# EAGLE design M8-Quad-420mA-Boost (EAGLE 9.6.2)
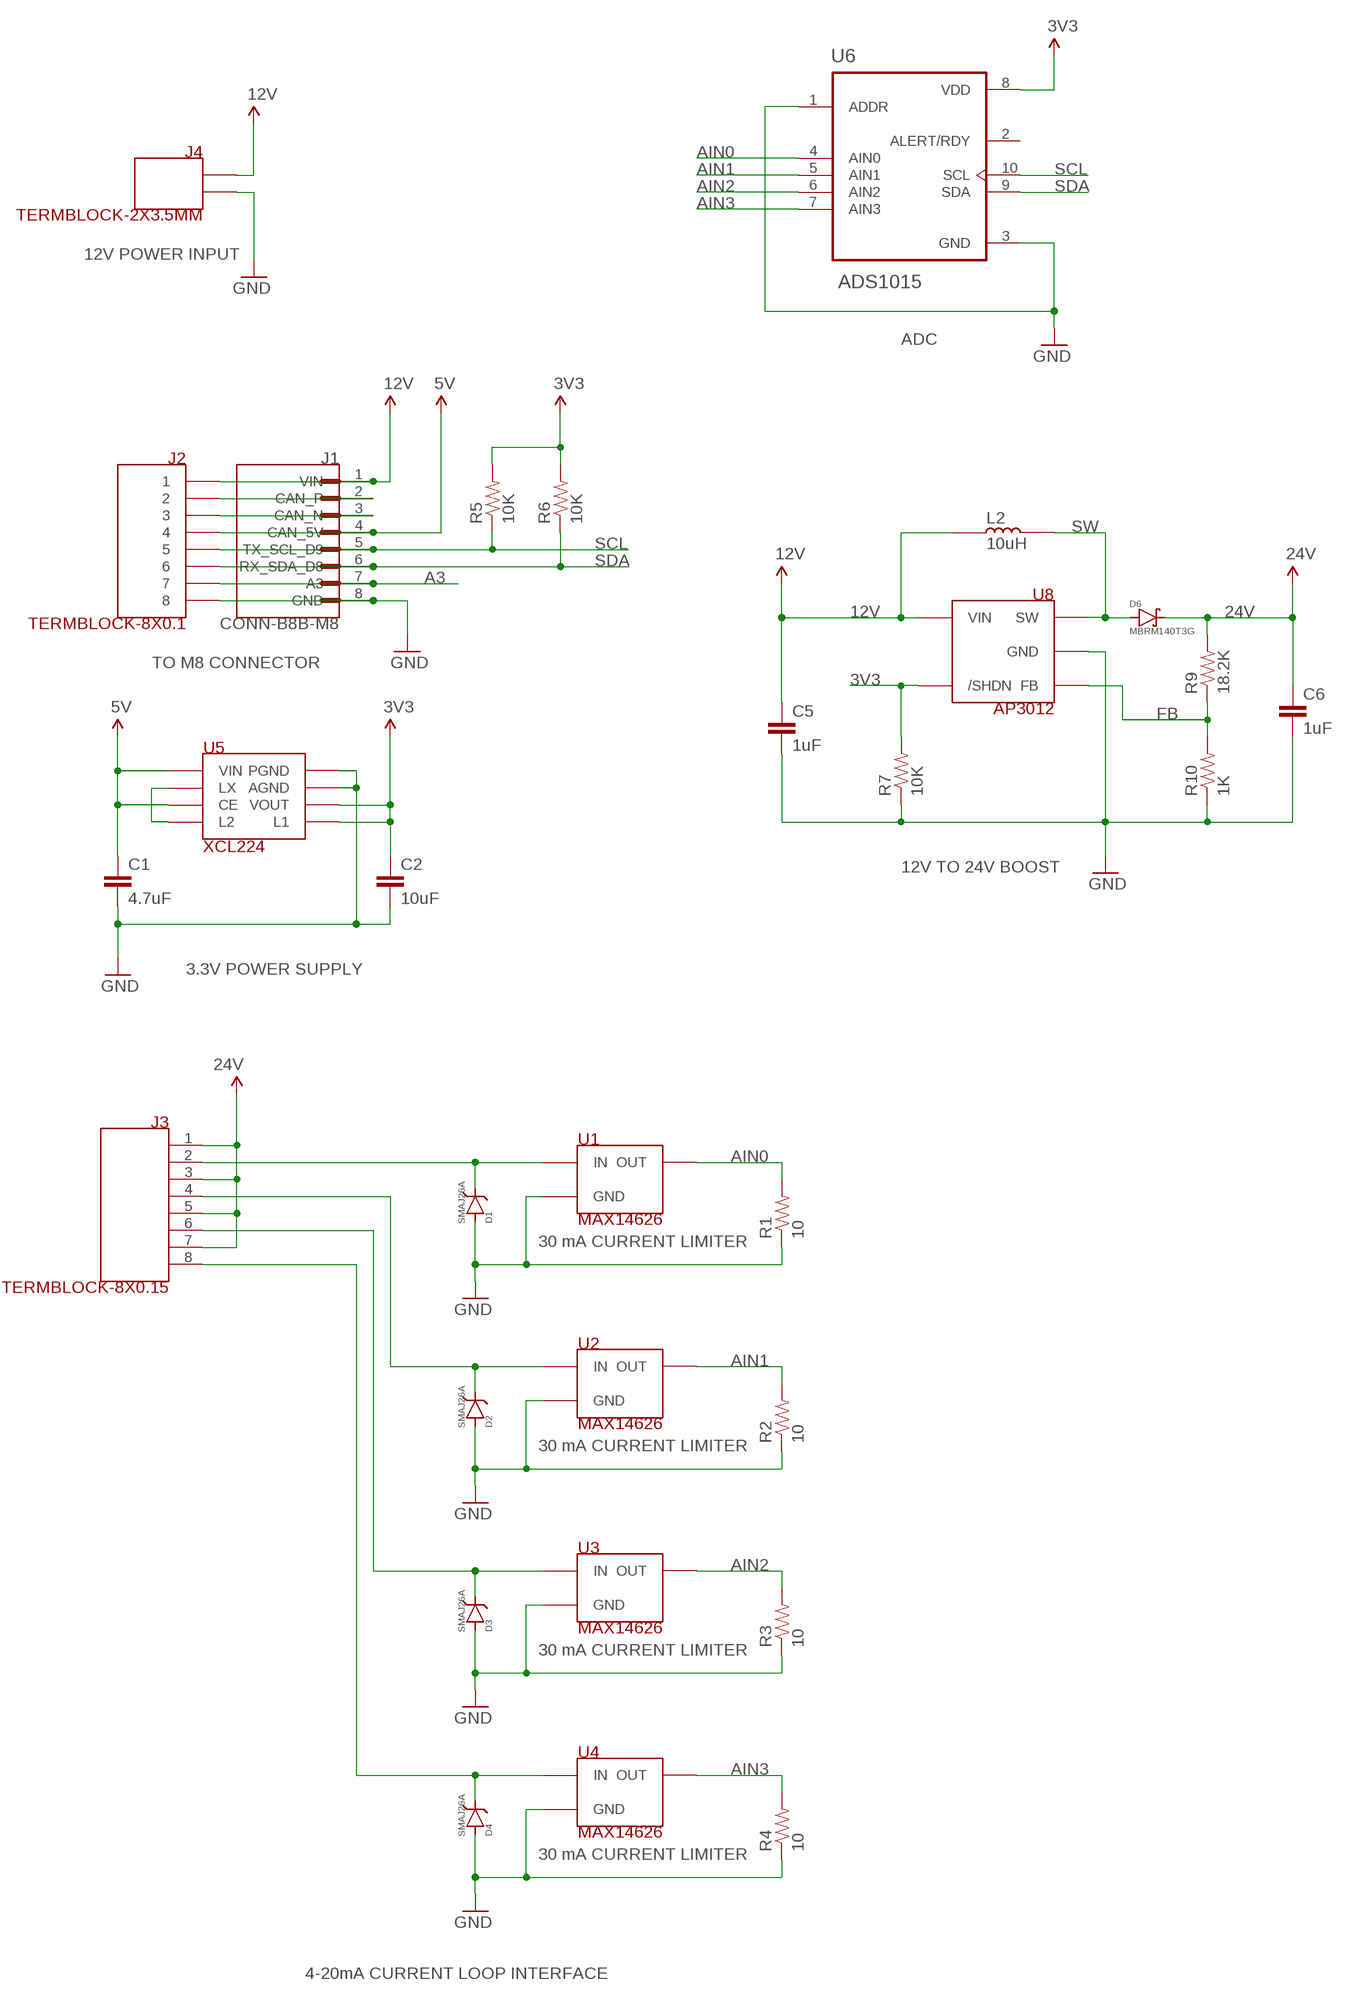
[diagram p0: schematic, sheet 1]

## Parts
C1  4.7uF  CAP-4.7UF-0603  [0603-CAP]
C2  10uF  CAP-10UF-0603  [0603-CAP]
C5  1uF  CAP-1UF-0603.DEV  [0603-CAP]
C6  1uF  CAP-1UF-0603.DEV  [0603-CAP]
D1  SMAJ26A  DIODE-TVS-SMAJ26A  [DO-214AC-LITTELFUSE]
D2  SMAJ26A  DIODE-TVS-SMAJ26A  [DO-214AC-LITTELFUSE]
D3  SMAJ26A  DIODE-TVS-SMAJ26A  [DO-214AC-LITTELFUSE]
D4  SMAJ26A  DIODE-TVS-SMAJ26A  [DO-214AC-LITTELFUSE]
D6  MBRM140T3G  [MBRM140T3G]
J1  CONN-B8B-M8  [JST_B8B-PH-SM4-TB(LF)(SN)]
J2  TERMBLOCK-8X0.1  [TERMBLOCK-8X0.1]
J3  TERMBLOCK-8X0.15  [TERMBLOCK-8X0.15]
J4  TERMBLOCK-2X3.5MM  [TERMBLOCK-2X3.5MM]
L2  10uH  INDUCTOR-10UH  [BOURNS-INDUCTOR-3X3]
R1  10  RES-100-0603.DEV  [0603-RES]
R2  10  RES-100-0603.DEV  [0603-RES]
R3  10  RES-100-0603.DEV  [0603-RES]
R4  10  RES-100-0603.DEV  [0603-RES]
R5  10K  RES-10K-06030603  [0603-RES]
R6  10K  RES-10K-06030603  [0603-RES]
R7  10K  RES-10K-06030603  [0603-RES]
R9  18.2K  RES-18.2K-06030603  [0603-RES]
R10  1K  RES-2.2K-06030603  [0603-RES]
U1  MAX14626  [6-TDFN-MAXIM]
U2  MAX14626  [6-TDFN-MAXIM]
U3  MAX14626  [6-TDFN-MAXIM]
U4  MAX14626  [6-TDFN-MAXIM]
U5  XCL224  REG-XCL223  [REG-XCL223-LESS-CREAM]
U6  ADS1015  ADS1015IDGSR  [SOP50P490X110-10N]
U8  AP3012  [SOT-23-5]

## Nets
3V3: C2.1 R5.2 R6.2 R7.2 U5.3(VOUT) U5.7(L1) U6.8(VDD) U8.4(/SHDN)
5V: C1.1 J1.4(CAN_5V) J2.P$4 U5.4(CE) U5.6(VIN)
12V: C5.1 J1.1(VIN) J2.P$1 J4.1 L2.1 U8.5(VIN)
24V: C6.1 D6.1(CATHODE) J3.1 J3.3 J3.5 J3.7 R9.2
A3: J1.7(A3) J2.P$7
AIN0: R1.2 U1.6(OUT) U6.4(AIN0)
AIN1: R2.2 U2.6(OUT) U6.5(AIN1)
AIN2: R3.2 U3.6(OUT) U6.6(AIN2)
AIN3: R4.2 U4.6(OUT) U6.7(AIN3)
CAN_N: J1.3(CAN_N) J2.P$3
CAN_P: J1.2(CAN_P) J2.P$2
FB: R9.1 R10.2 U8.3(FB)
GND: C1.2 C2.2 C5.2 C6.2 D1.A(ANODE) D2.A(ANODE) D3.A(ANODE) D4.A(ANODE) J1.8(GND) J2.P$8 J4.2 R1.1 R2.1 R3.1 R4.1 R7.1 R10.1 U1.2(GND) U1.3(GND) U1.4(GND) U1.5(GND) U1.EP(GND) U2.2(GND) U2.3(GND) U2.4(GND) U2.5(GND) U2.EP(GND) U3.2(GND) U3.3(GND) U3.4(GND) U3.5(GND) U3.EP(GND) U4.2(GND) U4.3(GND) U4.4(GND) U4.5(GND) U4.EP(GND) U5.1(PGND) U5.2(AGND) U6.1(ADDR) U6.3(GND) U8.2(GND)
LX: U5.5(LX) U5.8(L2)
SCL: J1.5(TX_SCL_D9) J2.P$5 R5.1 U6.10(SCL)
SDA: J1.6(RX_SDA_D8) J2.P$6 R6.1 U6.9(SDA)
SEN1: D1.C(CATHODE) J3.2 U1.1(IN)
SEN2: D2.C(CATHODE) J3.4 U2.1(IN)
SEN3: D3.C(CATHODE) J3.6 U3.1(IN)
SEN4: D4.C(CATHODE) J3.8 U4.1(IN)
SW: D6.2(ANODE) L2.2 U8.1(SW)
Unconnected: U6.2(ALERT/RDY)

## Notes on the sheet
- 12V POWER INPUT
- ADC
- TO M8 CONNECTOR
- 12V TO 24V BOOST
- 3.3V POWER SUPPLY
- 30 mA CURRENT LIMITER
- 30 mA CURRENT LIMITER
- 30 mA CURRENT LIMITER
- 30 mA CURRENT LIMITER
- 4-20mA CURRENT LOOP INTERFACE

## Library data of the parts
C1 = rickk2:CAP-4.7UF-0603: Murata X5R series CAP CER 4.7UF 6.3V X5R 0603 $0.12 https://www.digikey.com/product-detail/en/murata-electronics-north-america/GRM188R60J475KE19J/490-6407-1-ND/3845604
C2 = rickk2:CAP-10UF-0603: CAP CER 10UF 16V X5R 0805 $ 0.21 https://www.digikey.com/product-detail/en/murata-electronics-north-america/GRM21BR61C106KE15L/490-3886-1-ND/965928
C5 C6 = rickk2:CAP-1UF-0603.DEV: CAP CER 1UF 25V X7R 0603 $ 0.10 Samsung CL10B105KA8NNNC https://www.digikey.com/product-detail/en/samsung-electro-mechanics-america-inc/CL10B105KA8NNNC/1276-1184-1-ND/3889270 1µF ±10% 25V Ceramic Capacitor X7R 0603 (1608 Metric)
D1-D4 = rickk2:DIODE-TVS-SMAJ26A: Not ordered yet TVS diode for 24V 4-20mA circuits Littelfuse Inc. SMAJ26A $ 0.36 TVS DIODE 26V 42.1V DO214AC 42.1V Clamp 9.5A Ipp Tvs Diode Surface Mount DO-214AC (SMA) https://www.digikey.com/product-detail/en/littelfuse-inc/SMAJ26A/SMAJ26ALFCT-ND/762502 Cathode (bar/stripe side) goes to signal, anode goes to GND
D6 = rickk2:MBRM140T3G: Not ordered yet Schottky Diode for 24V boost with MIC2288 ON Semiconductor MBRM140T3G $0.36 DIODE SCHOTTKY 40V 1A POWERMITE Diode Schottky 40V 1A Surface Mount Powermite https://www.digikey.com/product-detail/en/on-semiconductor/MBRM140T3G/MBRM140T3GOSCT-ND/917997
J1 = rickk2:CONN-B8B-M8: PH Series 2 mm Pitch 12 Position SMT Single Row Top Entry Shrouded Header
J2 = rickk2:TERMBLOCK-8X0.1: Term Block 8x0.1" 20-30AWG 6A 125V Max Side Entry On Shore Technology Inc. OSTVN08A150 TERM BLK 8P SIDE ENT 2.54MM PCB 8 Position Wire to Board Terminal Block Horizontal with Board 0.100" (2.54mm) Through Hole https://www.digikey.com/product-detail/en/on-shore-technology-inc/OSTVN08A150/ED10566-ND/1588868
J3 = rickk2:TERMBLOCK-8X0.15: On Shore Technology Term Block 3.81 mm (.15”) Side with screw terminals: Plug, Female Sockets Board side: 90deg, Header, Male Pins, Shrouded (4 Side) TERM BLOCK HDR 8POS 90DEG 3.81MM $1.35 https://www.digikey.com/product-detail/en/on-shore-technology-inc/OSTOQ083251/ED2814-ND/1588131 TERM BLOCK PLUG 8POS STR 3.81MM $ 3.29 OSTTJ0831530 https://www.digikey.com/product-detail/en/on-shore-technology-inc/OSTTJ0831530/ED2881-ND/1588456
J4 = rickk2:TERMBLOCK-2X3.5MM: TERM BLK 2POS SIDE ENT 3.5MM PCB $0.67 On Shore Technology Inc. OSTTE020161M https://www.digikey.com/products/en?keywords=ED2635-ND
L2 = rickk2:INDUCTOR-10UH: Bourns Inc. SRN3015-100M $0.46 FIXED IND 10UH 1A 276 MOHM SMD 10µH Semi-Shielded Wirewound Inductor 1A 276 mOhm Max Nonstandard https://www.digikey.com/product-detail/en/bourns-inc/SRN3015-100M/SRN3015-100MCT-ND/2756149
R1-R4 = rickk2:RES-100-0603.DEV: RES SMD 100 OHM 5% 1/10W 0603 $ 0.10 ±5% 0.1W, 1/10W Chip Resistor 0603 (1608 Metric) Automotive AEC-Q200 Thick Film https://www.digikey.com/product-detail/en/panasonic-electronic-components/ERJ-3GEYJ101V/P100GCT-ND/134714; VALUE: 100
R5-R7 = rickk2:RES-10K-0603: RES SMD 10K OHM 5% 1/4W 0603 $ 0.10 https://www.digikey.com/product-detail/en/panasonic-electronic-components/ERJ-PA3J103V/P10KBZCT-ND/5036237
R9 = rickk2:RES-18.2K-0603: Panasonic Electronic Components ERJ-PB3B1822V $0.25 RES SMD 18.2K OHM 0.1% 1/5W 0603 18.2 kOhms ±0.1% 0.2W, 1/5W Chip Resistor 0603 (1608 Metric) Automotive AEC-Q200, Pulse Withstanding Thick Film https://www.digikey.com/product-detail/en/panasonic-electronic-components/ERJ-PB3B1822V/P20114CT-ND/6214369
R10 = rickk2:RES-2.2K-0603: Panasonic Electronic Components ERJ-3EKF2201V RES SMD 2.2K OHM 1% 1/10W 0603 2.2 kOhms ±1% 0.1W, 1/10W Chip Resistor 0603 (1608 Metric) Automotive AEC-Q200 Thick Film https://www.digikey.com/product-detail/en/panasonic-electronic-components/ERJ-3EKF2201V/P2.20KHCT-ND/1746742; VALUE: 2.2K
U1-U4 = rickk2:MAX14626: Not ordered yet Current limiter 30mA for 4-20mA current loop Maxim Integrated MAX14626ETT+T $1.32 IC CURR LOOP PROT 4-20MA 6TDFN https://www.digikey.com/product-detail/en/maxim-integrated/MAX14626ETT-T/MAX14626ETT-TCT-ND/4245424
U5 = rickk2:REG-XCL223: Manufacturer: Torex Semiconductor Ltd Manufacturer Part Number: XCL223A333D2-G DC DC CONVERTER 3.3V Detailed Description: Non-Isolated PoL Modul $2.63 https://www.digikey.com/product-detail/en/torex-semiconductor-ltd/XCL223A333D2-G/893-1416-1-ND/8256118 CIN=4.7uF 10V CL = 10uF 10V VIN MAX=5.5V VOUT=3.3V; VALUE: XCL223
U6 = rickk2:ADS1015IDGSR: 12-Bit ADC with Integrated MUX, PGA, Comparator, Oscillator, and Reference 10-VSSOP -40 to 125; DESCRIPTION: 12 Bit Analog to Digital Converter 2, 4 Input 1 Sigma-Delta 10-VSSOP; DIGI-KEY_PART_NUMBER: 296-41185-1-ND; MF: Texas Instruments; MP: ADS1015IDGSR; PACKAGE: MSOP-10 Texas Instruments; TEXAS_INSTRUMENTS-PURCHASE-URL: https://snapeda.com/shop?store=Texas+Instruments&id=449361
U8 = rickk2:AP3012: Diodes Incorporated AP3012KTR-G1 $0.47 IC REG BOOST ADJ 500MA SOT23-5 Boost Switching Regulator IC Positive Adjustable 1.25V 1 Output 500mA (Switch) SC-74A, SOT-753 https://www.digikey.com/product-detail/en/diodes-incorporated/AP3012KTR-G1/AP3012KTR-G1DICT-ND/4505297 Used for 12V to 24V boost for 4-20mA

## Board
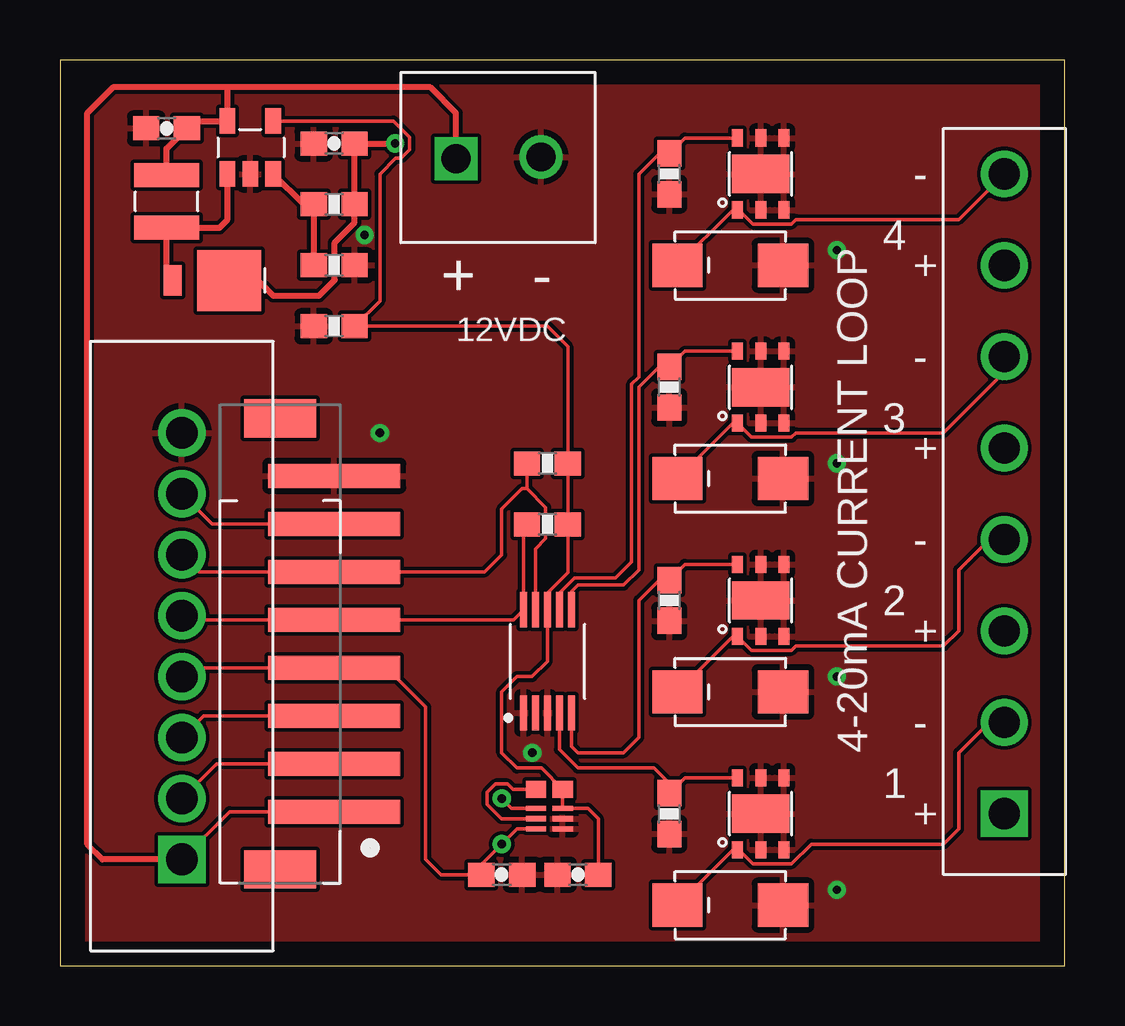
[diagram p1: board, top side]
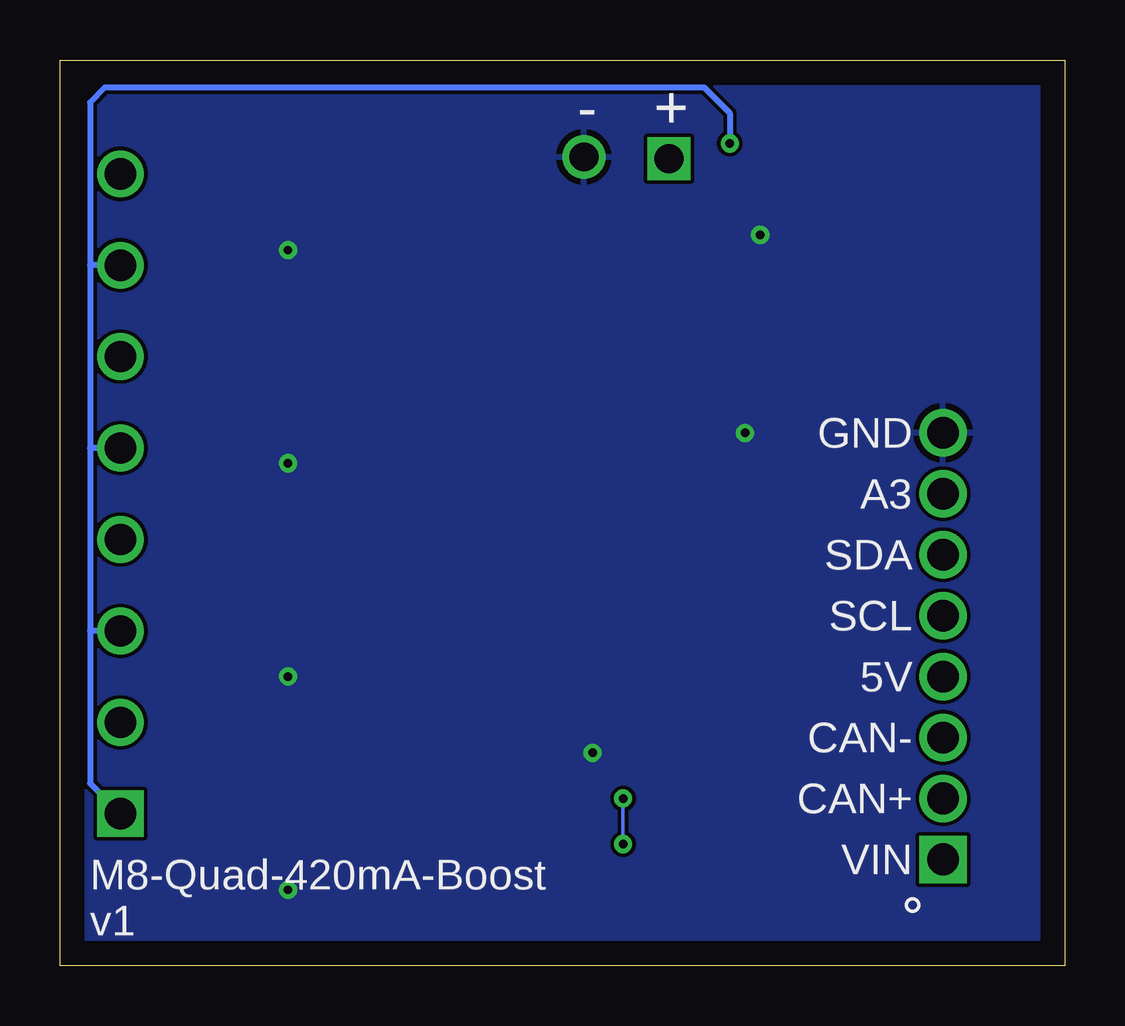
[diagram p2: board, bottom side, seen from below]

Size 41.89 x 37.77 mm. Coordinates in mm from the lower left corner, seen from the top.
Outline: 0,0 41.89,0 41.89,37.77 0,37.77 0,0
Copper layers (1*16): Top 0.035mm / dielectric 1.5mm / Bottom 0.035mm
Design rules "default": minimum track width 6mil, minimum drill 0.35mm, track to track 6mil, track to pad 6mil, pad to pad 6mil, via to via 6mil, smd to smd 6mil, copper to edge 40mil, drill to drill 6mil, minimum pad ring 10mil, minimum via ring 8mil, stop-mask expansion 4mil, vias tented up to drill 0mil, thermal gap 10mil

### Footprints (pad centres in the part's own frame; a part is rotated, then mirrored left to right if it is on the bottom)
0603-CAP = smd 1.1 x 1: 1 -0.85,0; 2 0.85,0
DO-214AC-LITTELFUSE = smd 2.1 x 1.8: A 2.2,0; C -2.2,0
MBRM140T3G = smd 2.67 x 2.54: 1 -0.695,0 | smd 0.762 x 1.27: 2 1.65,0
JST_B8B-PH-SM4-TB(LF)(SN) = smd 1 x 5.5: 1 -5,0; 2 -3,0; 3 -1,0; 4 1,0; 5 3,0; 6 5,0; 7 7,0; 8 9,0 | smd 1.6 x 3: P1 -7.4,2.25; P2 11.4,2.25
TERMBLOCK-8X0.1 = drill 1.321 square: P$1 -8.89,0 | drill 1.321: P$2 -6.35,0; P$3 -3.81,0; P$4 -1.27,0; P$5 1.27,0; P$6 3.81,0; P$7 6.35,0; P$8 8.89,0
TERMBLOCK-8X0.15 = drill 1.3 square: 1 0,0 | drill 1.3: 2 3.81,0; 3 7.62,0; 4 11.43,0; 5 15.24,0; 6 19.05,0; 7 22.86,0; 8 26.67,0
TERMBLOCK-2X3.5MM = drill 1.2 square: 1 0,0 | drill 1.2: 2 3.54,0.07
BOURNS-INDUCTOR-3X3 = smd 2.7 x 1: 1 0,1.1; 2 0,-1.1
0603-RES = smd 1.1 x 1: 1 -0.85,0; 2 0.85,0
6-TDFN-MAXIM = smd 0.46 x 0.71: 1 -0.965,-1.5; 2 0,-1.5; 3 0.965,-1.5; 4 0.965,1.5; 5 0,1.5; 6 -0.965,1.5 | smd 2.39 x 1.6: EP 0,0
REG-XCL223-LESS-CREAM = smd 0.85 x 0.21: 1 0,0; 2 0,0.43; 3 0,0.86; 4 -1.11,0.86; 5 -1.11,0.43; 6 -1.11,0 | smd 0.85 x 0.7: 7 0,1.655; 8 -1.11,1.655
SOP50P490X110-10N = smd 1.47 x 0.28: 1 -2.15,1; 2 -2.15,0.5; 3 -2.15,0; 4 -2.15,-0.5; 5 -2.15,-1; 6 2.15,-1; 7 2.15,-0.5; 8 2.15,0; 9 2.15,0.5; 10 2.15,1
SOT-23-5 = smd 0.65 x 1.06: 1 0,0; 2 0.95,0; 3 1.9,0; 4 1.9,2.2; 5 0,2.2

### Placement (x,y rotation side)
C1  18.41,3.81 0 top
C2  21.59,3.81 180 top
C5  4.45,34.92 180 top
C6  11.43,34.29 180 top
D1  27.94,2.54 0 top
D2  27.94,11.43 0 top
D3  27.94,20.32 0 top
D4  27.94,29.21 0 top
D6  6.35,28.57 180 top
J1  11.43,11.43 90 top
J2  5.08,13.34 90 top
J3  39.37,6.35 90 top
J4  16.51,33.66 0 top
L2  4.45,31.88 0 top
R1  100  [0603-RES]  25.4,6.35 90 top
R2  100  [0603-RES]  25.4,15.24 90 top
R3  100  [0603-RES]  25.4,24.13 90 top
R4  100  [0603-RES]  25.4,33.02 90 top
R5  20.32,18.41 0 top
R6  20.32,20.95 0 top
R7  11.43,26.67 0 top
R9  11.43,31.75 0 top
R10  11.43,29.21 180 top
U1  29.21,6.35 0 top
U2  29.21,15.24 0 top
U3  29.21,24.13 0 top
U4  29.21,33.02 0 top
U5  20.95,5.71 0 top
U6  20.32,12.7 90 top
U8  6.99,33.02 0 top

### Tracks (layer width: path | path; a pad name or v marks a point on that pad's centre or on a via)
3V3
  Top 0.152: C2.1 22.44,6.13 22,6.58 U5.3 U5.7 20.07,8.26 19.05,8.26 18.41,8.89 18.41,11.43 19.05,12.06 19.68,12.06 20.32,12.7 U6.8 20.32,15.55 21.17,16.4 R5.2 R6.2 21.17,25.82 20.32,26.67 R7.2 13.34,27.73 13.34,33.02 14,33.68 14.22,33.68 14.58,34.04 14.58,34.54 13.9,35.22 U8.4
5V  (via drill 0.35)
  Top 0.152: U5.4 18.82,6.58 v18.41,6.99 | U5.6 19.05,5.71 v18.41,5.08 17.57,4.23 C1.1 15.88,3.81 15.24,4.45 15.24,10.79 13.61,12.43 J1.4 5.45,12.43 J2.P$4
  Bottom 0.152: v18.41,6.99 v18.41,5.08
12V
  Top 0.152: J2.P$1 7.07,6.43 J1.1
  Top 0.254: J2.P$1 1.78,4.45 1.14,5.08 1.14,35.56 2.21,36.63 6.99,36.63 | J4.1 16.51,35.56 15.44,36.63 6.99,36.63 | 6.99,36.63 U8.5 5.59,35.22 C5.1 4.45,34.08 L2.1
24V  (via drill 0.35)
  Top 0.254: D6.1 8.26,28.57 8.89,27.94 10.79,27.94 11.45,28.6 11.45,30.16 12.28,30.99 R9.2 C6.1 v13.97,34.29
  Bottom 0.254: v13.97,34.29 13.97,35.56 15.04,36.63 40.01,36.63 40.64,35.99 40.64,29.21 | J3.1 40.64,7.62 40.64,13.97 | 40.64,29.21 40.64,21.59 | 40.64,21.59 40.64,13.97 | J3.3 40.64,13.97 | J3.5 40.64,21.59 | J3.7 40.64,29.21
A3
  Top 0.152: J1.7 6.33,18.43 J2.P$7
AIN0
  Top 0.152: U6.4 20.82,9.03 21.59,8.26 24.77,8.26 25.4,7.62 R1.2 26.05,7.85 U1.6
AIN1
  Top 0.152: U2.6 26.05,16.74 R2.2 24.98,16.09 24.13,15.24 24.13,9.53 23.5,8.89 21.59,8.89 21.32,9.16 U6.5
AIN2
  Top 0.152: U3.6 26.05,25.63 R3.2 24.98,24.98 24.13,24.13 24.13,16.51 23.5,15.88 21.59,15.88 21.32,15.61 U6.6
AIN3
  Top 0.152: U4.6 26.05,34.52 R4.2 24.98,33.87 24.13,33.02 24.13,24.56 23.82,24.26 23.82,16.84 23.16,16.18 21.45,16.18 20.82,15.55 U6.7
CAN_N
  Top 0.152: J1.3 5.99,10.43 J2.P$3
CAN_P
  Top 0.152: J1.2 6.53,8.43 J2.P$2
FB
  Top 0.254: U8.3 10.15,31.75 R9.1 R10.2
GND  (via drill 0.35)
  other vias: 13.34,22.23 19.68,8.89 32.38,29.84 32.38,20.95 32.38,12.06 32.38,3.17 12.7,30.48
  pour Top: 0,0 0,54.61 45.72,54.61 45.72,0
  pour Bottom: 0,0 0,53.34 46.99,53.34 46.99,0
LX
  Top 0.152: U5.8 18.89,7.37 18.67,7.59 18.16,7.59 17.81,7.24 17.81,6.73 18.4,6.14 U5.5
SCL
  Top 0.152: J2.P$5 5.25,14.43 J1.5 18.9,14.43 U6.10 19.32,18.27 R5.1
SDA
  Top 0.152: J2.P$6 5.79,16.43 J1.6 17.7,16.43 18.41,17.14 18.41,19.05 19.27,19.9 19.47,19.9 | U6.9 19.82,17.39 20.25,17.82 20.25,19.12 19.47,19.9 | 19.47,19.9 R6.1
SEN1
  Top 0.152: D1.C 28.05,4.85 U1.1 28.3,4.85 28.89,4.27 30.5,4.27 31.31,5.08 36.83,5.08 37.47,5.71 37.47,8.89 38.73,10.16 J3.2
SEN2
  Top 0.152: D2.C 28.05,13.74 U2.1 28.83,13.16 30.5,13.16 30.68,13.34 36.83,13.34 37.47,13.97 37.47,16.51 38.73,17.78 J3.4
SEN3
  Top 0.152: D3.C 28.05,22.63 U3.1 28.83,22.05 30.5,22.05 30.68,22.23 36.83,22.23 39.37,24.77 J3.6
SEN4
  Top 0.152: D4.C 28.05,31.52 U4.1 28.3,31.52 28.89,30.94 30.5,30.94 30.68,31.11 37.47,31.11 J3.8
SW
  Top 0.254: D6.2 4.45,28.83 L2.2 6.65,30.78 6.99,31.11 U8.1

### Text on the board
tPlace: - | 4 | + | + | - | 12VDC | - | 3 | + | - | 2 | + | - | 4-20mA CURRENT LOOP | 1 | +
bPlace: + | - | GND | A3 | SDA | SCL | 5V | CAN- | CAN+ | VIN | M8-Quad-420mA-Boost / v1